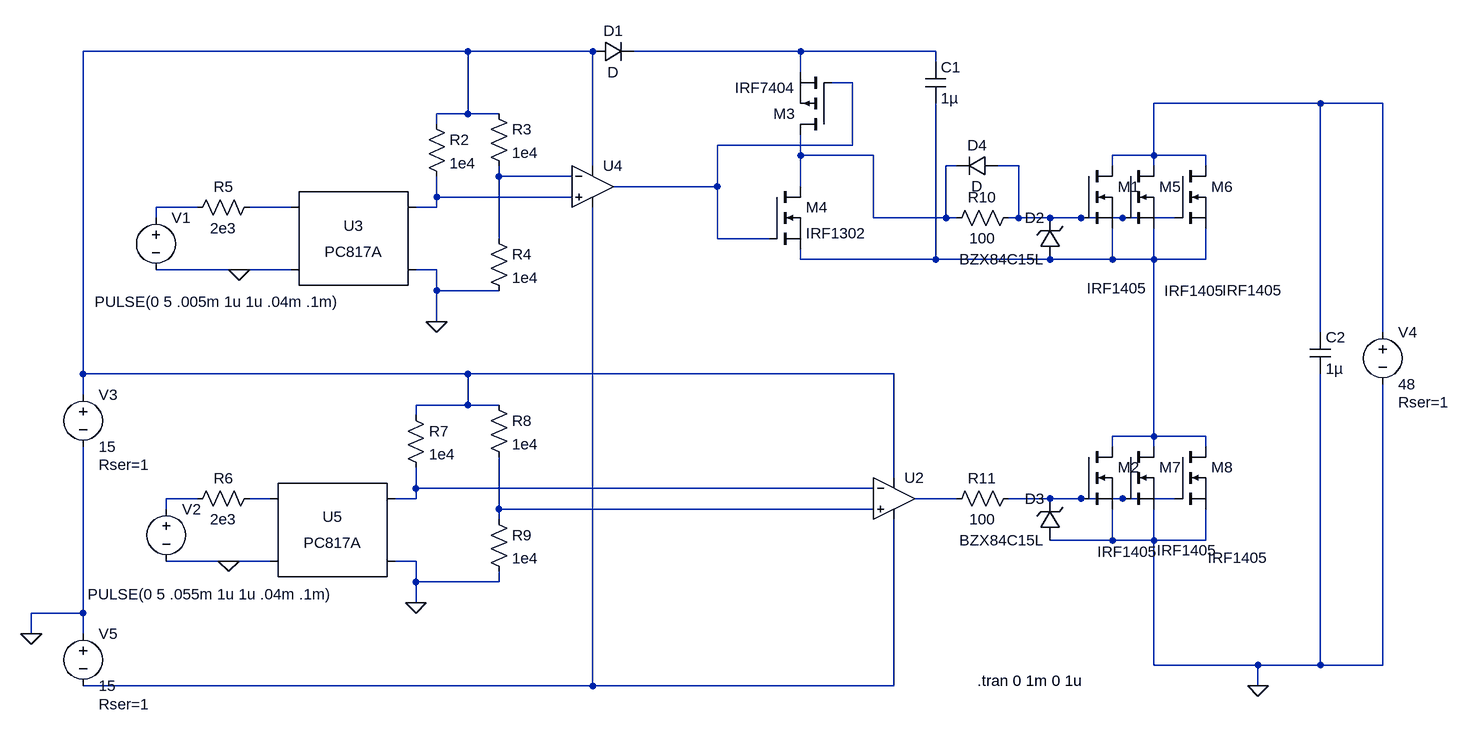
[diagram p0: schematic Inverter.asc]
Inverter.asc, the LTspice schematic file:
Version 4
SHEET 1 1084 844
WIRE -432 -240 -1024 -240
WIRE -240 -240 -432 -240
WIRE 80 -240 -176 -240
WIRE 288 -240 80 -240
WIRE 288 -224 288 -240
WIRE 80 -208 80 -240
WIRE 160 -192 128 -192
WIRE 880 -160 624 -160
WIRE 976 -160 880 -160
WIRE -432 -144 -432 -240
WIRE -432 -144 -480 -144
WIRE -384 -144 -432 -144
WIRE -480 -128 -480 -144
WIRE 160 -96 160 -192
WIRE 160 -96 -48 -96
WIRE 80 -80 80 -112
WIRE 192 -80 80 -80
WIRE 624 -80 624 -160
WIRE 624 -80 560 -80
WIRE 704 -80 624 -80
WIRE -240 -64 -240 -240
WIRE 320 -64 304 -64
WIRE 416 -64 384 -64
WIRE 560 -64 560 -80
WIRE 624 -64 624 -80
WIRE 704 -64 704 -80
WIRE -384 -48 -384 -64
WIRE -272 -48 -384 -48
WIRE -48 -32 -48 -96
WIRE -48 -32 -208 -32
WIRE 80 -32 80 -80
WIRE -480 -16 -480 -48
WIRE -272 -16 -480 -16
WIRE -848 0 -912 0
WIRE -704 0 -768 0
WIRE -480 0 -480 -16
WIRE -480 0 -512 0
WIRE -912 16 -912 0
WIRE 192 16 192 -80
WIRE 304 16 304 -64
WIRE 304 16 192 16
WIRE 320 16 304 16
WIRE 416 16 416 -64
WIRE 416 16 400 16
WIRE 464 16 416 16
WIRE 512 16 464 16
WIRE 576 16 512 16
WIRE 656 16 576 16
WIRE -384 48 -384 -48
WIRE -48 48 -48 -32
WIRE 32 48 -48 48
WIRE 80 80 80 64
WIRE 288 80 288 -160
WIRE 288 80 80 80
WIRE 464 80 288 80
WIRE 560 80 560 32
WIRE 560 80 464 80
WIRE 624 80 624 32
WIRE 624 80 560 80
WIRE 704 80 704 32
WIRE 704 80 624 80
WIRE -784 96 -912 96
WIRE -704 96 -784 96
WIRE -480 96 -512 96
WIRE -480 128 -480 96
WIRE -384 128 -480 128
WIRE -480 176 -480 128
WIRE 880 192 880 -160
WIRE 976 192 976 -160
WIRE -1024 256 -1024 -240
WIRE -432 256 -1024 256
WIRE 224 256 -432 256
WIRE -1024 288 -1024 256
WIRE -432 304 -432 256
WIRE -432 304 -512 304
WIRE -384 304 -432 304
WIRE -512 320 -512 304
WIRE 624 352 624 80
WIRE 624 352 560 352
WIRE 704 352 624 352
WIRE 560 368 560 352
WIRE 624 368 624 352
WIRE 704 368 704 352
WIRE 224 416 224 256
WIRE -512 432 -512 400
WIRE 192 432 -512 432
WIRE -848 448 -896 448
WIRE -736 448 -768 448
WIRE -512 448 -512 432
WIRE -512 448 -544 448
WIRE 320 448 256 448
WIRE 464 448 400 448
WIRE 512 448 464 448
WIRE 576 448 512 448
WIRE 656 448 576 448
WIRE -896 464 -896 448
WIRE -384 464 -384 384
WIRE 192 464 -384 464
WIRE -384 480 -384 464
WIRE 560 512 560 464
WIRE 560 512 464 512
WIRE 624 512 624 464
WIRE 624 512 560 512
WIRE 704 512 704 464
WIRE 704 512 624 512
WIRE -800 544 -896 544
WIRE -736 544 -800 544
WIRE -512 544 -544 544
WIRE -512 576 -512 544
WIRE -384 576 -384 560
WIRE -384 576 -512 576
WIRE -512 608 -512 576
WIRE -1024 624 -1024 368
WIRE -1024 624 -1104 624
WIRE -1104 656 -1104 624
WIRE -1024 656 -1024 624
WIRE 624 704 624 512
WIRE 784 704 624 704
WIRE 880 704 880 256
WIRE 880 704 784 704
WIRE 976 704 976 272
WIRE 976 704 880 704
WIRE -240 736 -240 0
WIRE -240 736 -1024 736
WIRE 224 736 224 480
WIRE 224 736 -240 736
WIRE 784 736 784 704
FLAG -1104 656 0
FLAG 784 736 0
FLAG -480 176 0
FLAG -512 608 0
FLAG -784 96 0
FLAG -800 544 0
SYMBOL voltage -912 0 R0
WINDOW 3 -94 145 Left 2
WINDOW 123 0 0 Left 2
WINDOW 39 0 0 Left 2
SYMATTR Value PULSE(0 5 .005m 1u 1u .04m .1m)
SYMATTR InstName V1
SYMBOL voltage -896 448 R0
WINDOW 3 -121 147 Left 2
WINDOW 123 0 0 Left 2
WINDOW 39 0 0 Left 2
SYMATTR Value PULSE(0 5 .055m 1u 1u .04m .1m)
SYMATTR InstName V2
SYMBOL voltage -1024 272 R0
WINDOW 123 0 0 Left 2
WINDOW 39 24 124 Left 2
SYMATTR SpiceLine Rser=1
SYMATTR InstName V3
SYMATTR Value 15
SYMBOL diode -240 -224 R270
WINDOW 0 32 32 VTop 2
WINDOW 3 0 32 VBottom 2
SYMATTR InstName D1
SYMBOL cap 272 -224 R0
SYMATTR InstName C1
SYMATTR Value 1µ
SYMATTR SpiceLine V=200 Irms=10 Rser=1
SYMBOL voltage 976 176 R0
WINDOW 123 0 0 Left 2
WINDOW 39 24 124 Left 2
SYMATTR SpiceLine Rser=1
SYMATTR InstName V4
SYMATTR Value 48
SYMBOL voltage -1024 640 R0
WINDOW 123 0 0 Left 2
WINDOW 39 24 124 Left 2
SYMATTR SpiceLine Rser=1
SYMATTR InstName V5
SYMATTR Value 15
SYMBOL Optos\\PC817A -608 48 R0
SYMATTR InstName U3
SYMBOL res -496 -144 R0
SYMATTR InstName R2
SYMATTR Value 1e4
SYMBOL res -400 -160 R0
SYMATTR InstName R3
SYMATTR Value 1e4
SYMBOL res -400 32 R0
SYMATTR InstName R4
SYMATTR Value 1e4
SYMBOL res -752 -16 R90
WINDOW 0 0 56 VBottom 2
WINDOW 3 32 56 VTop 2
SYMATTR InstName R5
SYMATTR Value 2e3
SYMBOL res -752 432 R90
WINDOW 0 0 56 VBottom 2
WINDOW 3 32 56 VTop 2
SYMATTR InstName R6
SYMATTR Value 2e3
SYMBOL res -528 304 R0
SYMATTR InstName R7
SYMATTR Value 1e4
SYMBOL res -400 288 R0
SYMATTR InstName R8
SYMATTR Value 1e4
SYMBOL res -400 464 R0
SYMATTR InstName R9
SYMATTR Value 1e4
SYMBOL Optos\\PC817A -640 496 R0
SYMATTR InstName U5
SYMBOL nmos 512 -64 R0
WINDOW 3 9 188 Left 2
SYMATTR Value IRF1405
SYMATTR InstName M1
SYMBOL nmos 512 368 R0
WINDOW 3 25 162 Left 2
SYMATTR Value IRF1405
SYMATTR InstName M2
SYMBOL cap 864 192 R0
SYMATTR InstName C2
SYMATTR Value 1µ
SYMBOL Opamps\\UniversalOpamp2 224 448 R0
SYMATTR InstName U2
SYMBOL Opamps\\UniversalOpamp2 -240 -32 R0
SYMATTR InstName U4
SYMBOL pmos 128 -112 R180
SYMATTR InstName M3
SYMATTR Value IRF7404
SYMBOL nmos 32 -32 R0
SYMATTR InstName M4
SYMATTR Value IRF1302
SYMBOL nmos 576 -64 R0
WINDOW 3 64 192 Left 2
SYMATTR Value IRF1405
SYMATTR InstName M5
SYMBOL nmos 656 -64 R0
WINDOW 3 73 191 Left 2
SYMATTR Value IRF1405
SYMATTR InstName M6
SYMBOL nmos 576 368 R0
WINDOW 3 52 159 Left 2
SYMATTR Value IRF1405
SYMATTR InstName M7
SYMBOL nmos 656 368 R0
WINDOW 3 51 171 Left 2
SYMATTR Value IRF1405
SYMATTR InstName M8
SYMBOL res 416 0 R90
WINDOW 0 0 56 VBottom 2
WINDOW 3 32 56 VTop 2
SYMATTR InstName R10
SYMATTR Value 100
SYMBOL res 416 432 R90
WINDOW 0 0 56 VBottom 2
WINDOW 3 32 56 VTop 2
SYMATTR InstName R11
SYMATTR Value 100
SYMBOL zener 480 80 R180
WINDOW 0 24 64 Left 2
WINDOW 3 24 0 Left 2
SYMATTR InstName D2
SYMATTR Value BZX84C15L
SYMBOL zener 480 512 R180
WINDOW 0 24 64 Left 2
WINDOW 3 24 0 Left 2
SYMATTR InstName D3
SYMATTR Value BZX84C15L
SYMBOL diode 384 -80 R90
WINDOW 0 0 32 VBottom 2
WINDOW 3 32 32 VTop 2
SYMATTR InstName D4
TEXT 352 728 Left 2 !.tran 0 1m 0 1u

The netlist it stands for:
* Inverter.asc
V1 N009 0 PULSE(0 5 .005m 1u 1u .04m .1m)
V2 N013 0 PULSE(0 5 .055m 1u 1u .04m .1m)
V3 N001 0 15 Rser=1
D1 N001 N002 D
C1 N002 N011 1µ V=200 Irms=10 Rser=1
V4 N004 0 48 Rser=1
V5 0 N018 15 Rser=1
XU3 N010 0 N008 0 PC817 Igain=1m
R2 N001 N008 1e4
R3 N001 N007 1e4
R4 N007 0 1e4
R5 N010 N009 2e3
R6 N014 N013 2e3
R7 N001 N012 1e4
R8 N001 N017 1e4
R9 N017 0 1e4
XU5 N014 0 N012 0 PC817 Igain=1m
M1 N004 N006 N011 N011 IRF1405
M2 N011 N016 0 0 IRF1405
C2 N004 0 1µ
XU2 N017 N012 N001 N018 N015 level.2 Avol=1Meg GBW=10Meg Slew=10Meg ilimit=25m rail=0 Vos=0 phimargin=45 en=0 enk=0 in=0 ink=0 Rin=500Meg  ; pins IN+ IN- V+ V- OUT
XU4 N008 N007 N001 N018 N003 level.2 Avol=1Meg GBW=10Meg Slew=10Meg ilimit=25m rail=0 Vos=0 phimargin=45 en=0 enk=0 in=0 ink=0 Rin=500Meg  ; pins IN+ IN- V+ V- OUT
M3 N005 N003 N002 N002 IRF7404
M4 N005 N003 N011 N011 IRF1302
M5 N004 N006 N011 N011 IRF1405
M6 N004 N006 N011 N011 IRF1405
M7 N011 N016 0 0 IRF1405
M8 N011 N016 0 0 IRF1405
R10 N006 N005 100
R11 N016 N015 100
D2 N011 N006 BZX84C15L
D3 0 N016 BZX84C15L
D4 N006 N005 D
.model D D
.lib standard.dio
.model NMOS NMOS
.model PMOS PMOS
.lib standard.mos
.tran 0 1m 0 1u
.lib PC817.sub
.lib UniversalOpamps2.sub
.backanno
.end